# Altium schematic sheet F28335_Level_Shifters.SchDoc
size Letter; DocumentNumber: 8; SheetNumber: 8; SheetTotal: 9
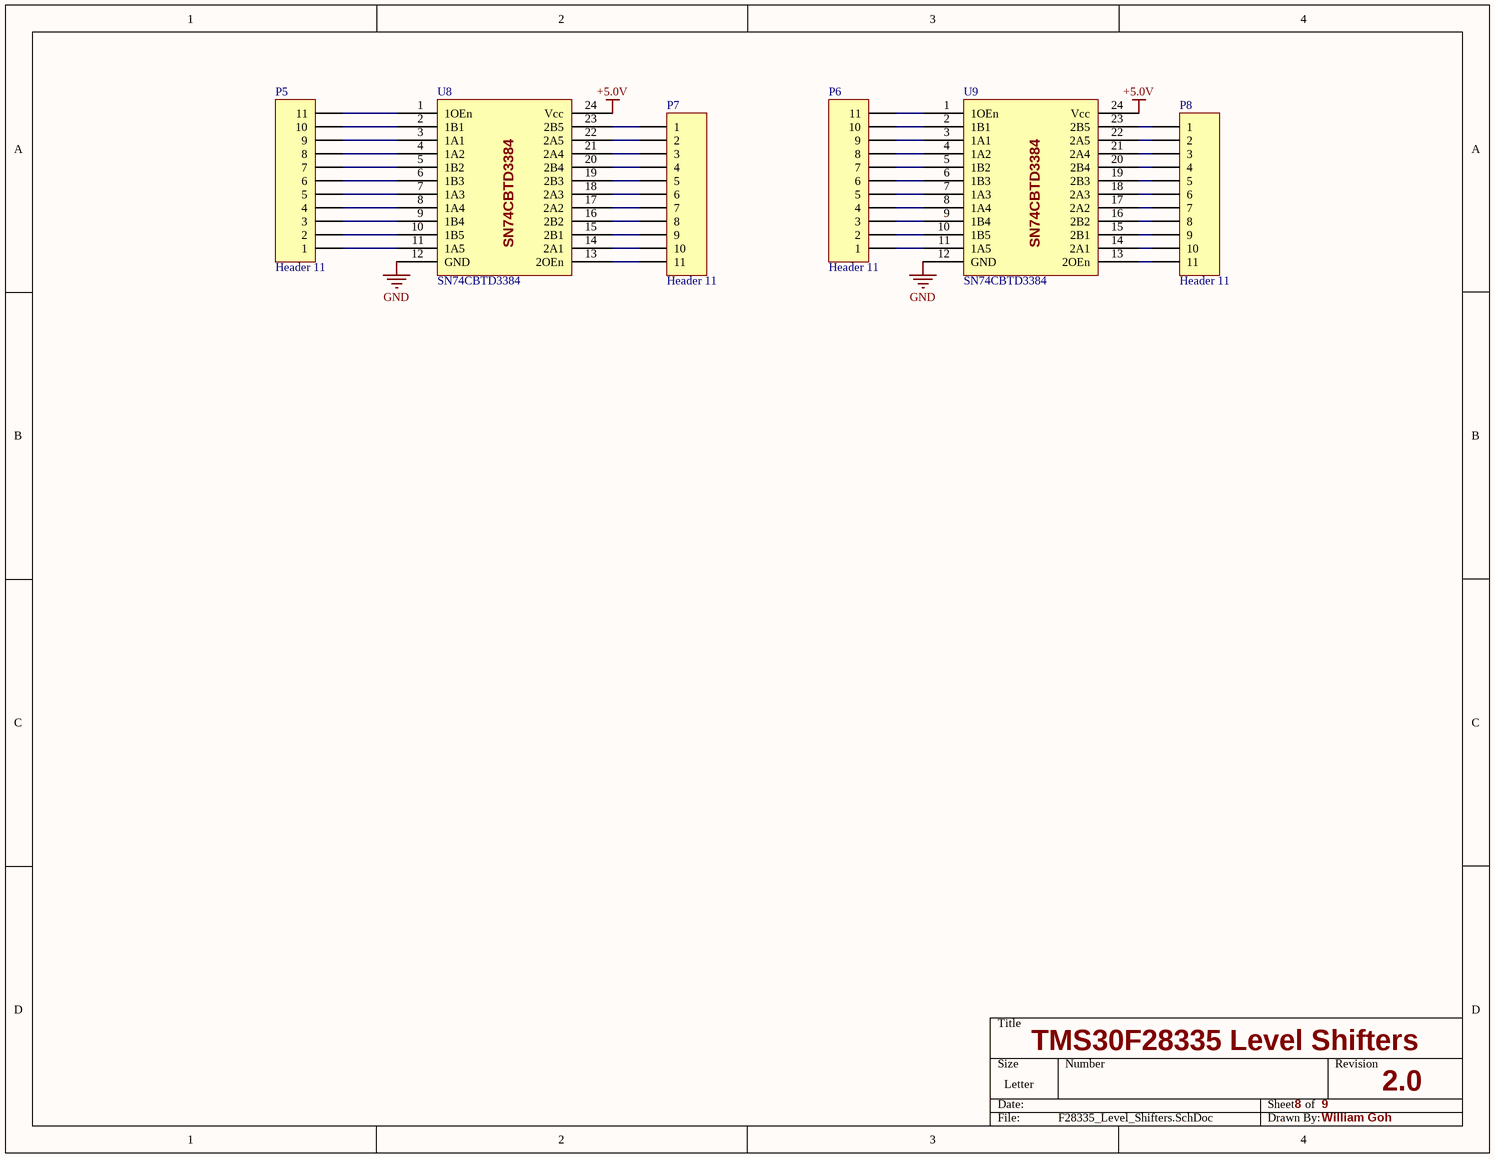
[diagram p0: F28335_Level_Shifters.SchDoc]

## Parts
P5  Header 11  [HDR1X11]
P6  Header 11  [HDR1X11]
P7  Header 11  [HDR1X11]
P8  Header 11  [HDR1X11]
U8  SN74CBTD3384  [DW-24]
U9  SN74CBTD3384  [DW-24]

## Nets
+5.0V: U8.24(Vcc) U9.24(Vcc)
GND: U8.12(GND) U9.12(GND)
NetP5_1: P5.1 U8.11(1A5)
NetP5_2: P5.2 U8.10(1B5)
NetP5_3: P5.3 U8.9(1B4)
NetP5_4: P5.4 U8.8(1A4)
NetP5_5: P5.5 U8.7(1A3)
NetP5_6: P5.6 U8.6(1B3)
NetP5_7: P5.7 U8.5(1B2)
NetP5_8: P5.8 U8.4(1A2)
NetP5_9: P5.9 U8.3(1A1)
NetP5_10: P5.10 U8.2(1B1)
NetP5_11: P5.11 U8.1(1OEn)
NetP6_1: P6.1 U9.11(1A5)
NetP6_2: P6.2 U9.10(1B5)
NetP6_3: P6.3 U9.9(1B4)
NetP6_4: P6.4 U9.8(1A4)
NetP6_5: P6.5 U9.7(1A3)
NetP6_6: P6.6 U9.6(1B3)
NetP6_7: P6.7 U9.5(1B2)
NetP6_8: P6.8 U9.4(1A2)
NetP6_9: P6.9 U9.3(1A1)
NetP6_10: P6.10 U9.2(1B1)
NetP6_11: P6.11 U9.1(1OEn)
NetP7_1: P7.1 U8.23(2B5)
NetP7_2: P7.2 U8.22(2A5)
NetP7_3: P7.3 U8.21(2A4)
NetP7_4: P7.4 U8.20(2B4)
NetP7_5: P7.5 U8.19(2B3)
NetP7_6: P7.6 U8.18(2A3)
NetP7_7: P7.7 U8.17(2A2)
NetP7_8: P7.8 U8.16(2B2)
NetP7_9: P7.9 U8.15(2B1)
NetP7_10: P7.10 U8.14(2A1)
NetP7_11: P7.11 U8.13(2OEn)
NetP8_1: P8.1 U9.23(2B5)
NetP8_2: P8.2 U9.22(2A5)
NetP8_3: P8.3 U9.21(2A4)
NetP8_4: P8.4 U9.20(2B4)
NetP8_5: P8.5 U9.19(2B3)
NetP8_6: P8.6 U9.18(2A3)
NetP8_7: P8.7 U9.17(2A2)
NetP8_8: P8.8 U9.16(2B2)
NetP8_9: P8.9 U9.15(2B1)
NetP8_10: P8.10 U9.14(2A1)
NetP8_11: P8.11 U9.13(2OEn)

## Notes on the sheet
- TMS30F28335 Level Shifters
- 2.0
- William Goh

## Library data of the parts
P5-P8 = Header 11: Header, 11-Pin; LatestRevisionDate: 17-Jul-2002; LatestRevisionNote: Re-released for DXP Platform.; Publisher: Altium Limited
U8 U9 = SN74CBTD3384: 10-Bit FET Bus Switches With Level Shifting; Digikey #: 296-6482-1-ND